# Altium schematic sheet BaseArduino.SchDoc
size A4
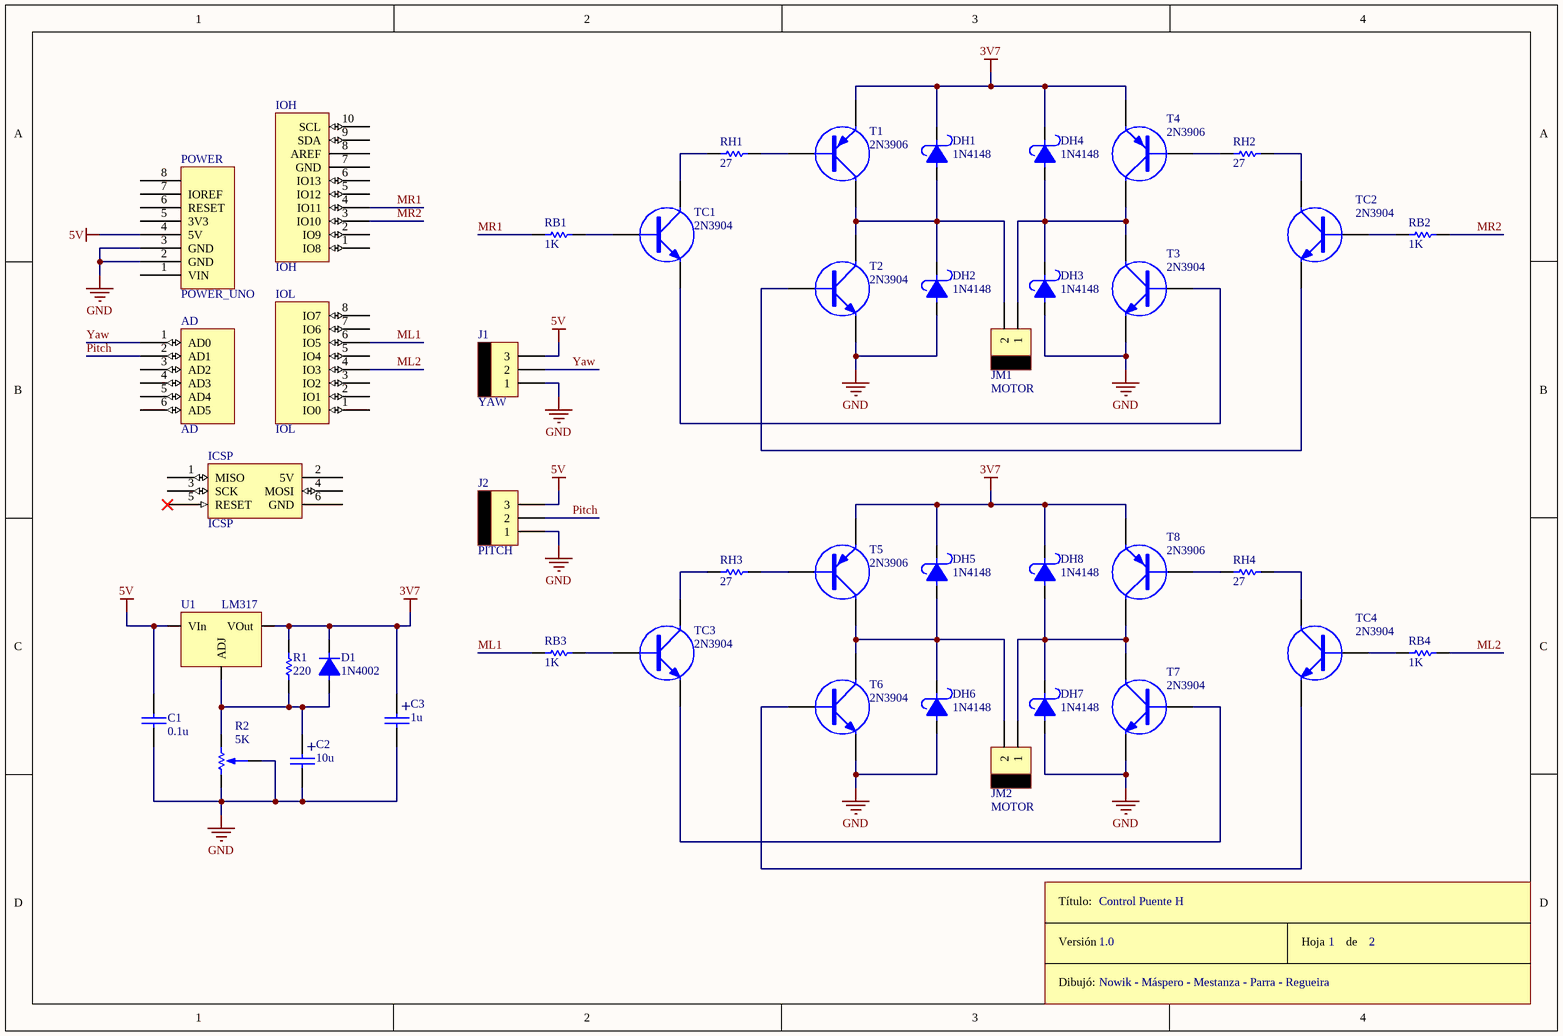
[diagram p0: BaseArduino.SchDoc]

## Parts
AD  AD  [Header 6x1 8.5mm]
C1  0.1u  [CAP100]
C2  10u  [CAP100RP]
C3  1u  [CAP100RP]
D1  1N4002  [DO41]
DH1  1N4148  [DO41]
DH2  1N4148  [DO41]
DH3  1N4148  [DO41]
DH4  1N4148  [DO41]
DH5  1N4148  [DO41]
DH6  1N4148  [DO41]
DH7  1N4148  [DO41]
DH8  1N4148  [DO41]
ICSP  ICSP  [ICSP]
IOH  IOH  [Header 10x1 8.5mm]
IOL  IOL  [Header 8x1 8.5mm]
J1  YAW  [MOLEX3]
J2  PITCH  [MOLEX3]
JM1  MOTOR  [MOLEX2]
JM2  MOTOR  [MOLEX2]
POWER  POWER_UNO  [Header 8x1 8.5mm]
R1  220  [RES300]
R2  5K  [PRESET V]
RB1  1K  [RES300]
RB2  1K  [RES300]
RB3  1K  [RES300]
RB4  1K  [RES300]
RH1  27  [RES300]
RH2  27  [RES300]
RH3  27  [RES300]
RH4  27  [RES300]
ROT1  Rótulo  (value not drawn)
T1  2N3906  [TO92]
T2  2N3904  [TO92]
T3  2N3904  [TO92]
T4  2N3906  [TO92]
T5  2N3906  [TO92]
T6  2N3904  [TO92]
T7  2N3904  [TO92]
T8  2N3906  [TO92]
TC1  2N3904  [TO92]
TC2  2N3904  [TO92]
TC3  2N3904  [TO92]
TC4  2N3904  [TO92]
U1  LM317  [TO-220 V]

## Nets
3V7: C3.1 D1.2 DH1.2 DH4.2 DH5.2 DH8.2 R1.2 T1.3(E) T4.3(E) T5.3(E) T8.3(E) U1.2(VOut)
5V: C1.1 J1.3 J2.3 POWER.4(5V) U1.3(VIn)
GND: C1.2 C2.2 C3.2 DH2.1 DH3.1 DH6.1 DH7.1 J1.1 J2.1 POWER.2(GND) POWER.3(GND) R2.2 R2.3 T2.3(E) T3.3(E) T6.3(E) T7.3(E)
ML1: IOL.6(IO5) RB3.1
ML2: IOL.4(IO3) RB4.2
MR1: IOH.4(IO11) RB1.1
MR2: IOH.3(IO10) RB2.2
Pitch: AD.2(AD1) J2.2
Yaw: AD.1(AD0) J1.2
NetC2_1: C2.1 D1.1 R1.1 R2.1 U1.1(ADJ)
NetDH1_1: DH1.1 DH2.2 JM1.2 T1.2(C) T2.2(C)
NetDH3_2: DH3.2 DH4.1 JM1.1 T3.2(C) T4.2(C)
NetDH5_1: DH5.1 DH6.2 JM2.2 T5.2(C) T6.2(C)
NetDH7_2: DH7.2 DH8.1 JM2.1 T7.2(C) T8.2(C)
NetRB1_2: RB1.2 TC1.1(B)
NetRB2_1: RB2.1 TC2.1(B)
NetRB3_2: RB3.2 TC3.1(B)
NetRB4_1: RB4.1 TC4.1(B)
NetRH1_1: RH1.1 TC1.2(C)
NetRH1_2: RH1.2 T1.1(B)
NetRH2_1: RH2.1 T4.1(B)
NetRH2_2: RH2.2 TC2.2(C)
NetRH3_1: RH3.1 TC3.2(C)
NetRH3_2: RH3.2 T5.1(B)
NetRH4_1: RH4.1 T8.1(B)
NetRH4_2: RH4.2 TC4.2(C)
NetT2_1: T2.1(B) TC2.3(E)
NetT3_1: T3.1(B) TC1.3(E)
NetT6_1: T6.1(B) TC4.3(E)
NetT7_1: T7.1(B) TC3.3(E)

Not connected (* = marked no-connect by the designer): AD 3(AD2) 4(AD3) 5(AD4) 6(AD5); ICSP 1(MISO) 2(5V) 3(SCK) 4(MOSI) 5(RESET)* 6(GND); IOH 1(IO8) 2(IO9) 5(IO12) 6(IO13) 7(GND) 8(AREF) 9(SDA) 10(SCL); IOL 1(IO0) 2(IO1) 3(IO2) 5(IO4) 7(IO6) 8(IO7); POWER 1(VIN) 5(3V3) 6(RESET) 7(IOREF) 8

## Notes on the sheet
- Control Puente H
- 1.0
- Nowik - Máspero - Mestanza - Parra - Regueira
- 1
- 2
- (in symbol CAPPOL) +
- (in symbol Rótulo) Título:; Versión; Hoja       de; Dibujó:

## Library data of the parts
C1 = CAP
C2 C3 = CAPPOL
D1 = DIODO
DH1-DH8 = DIODO SCHOTTKY
J1 J2 = MOLEX3
JM1 JM2 = MOLEX2
R1 RB1-RB4 RH1-RH4 = RES
R2 = PRESET
T1 T4 T5 T8 = TRANSISTOR PNP
T2 T3 T6 T7 TC1-TC4 = TRANSISTOR NPN
U1 = LM317: IC REG ADJ 1.5A 3 TERM TO-220